# EAGLE design testbed (EAGLE 5.09)
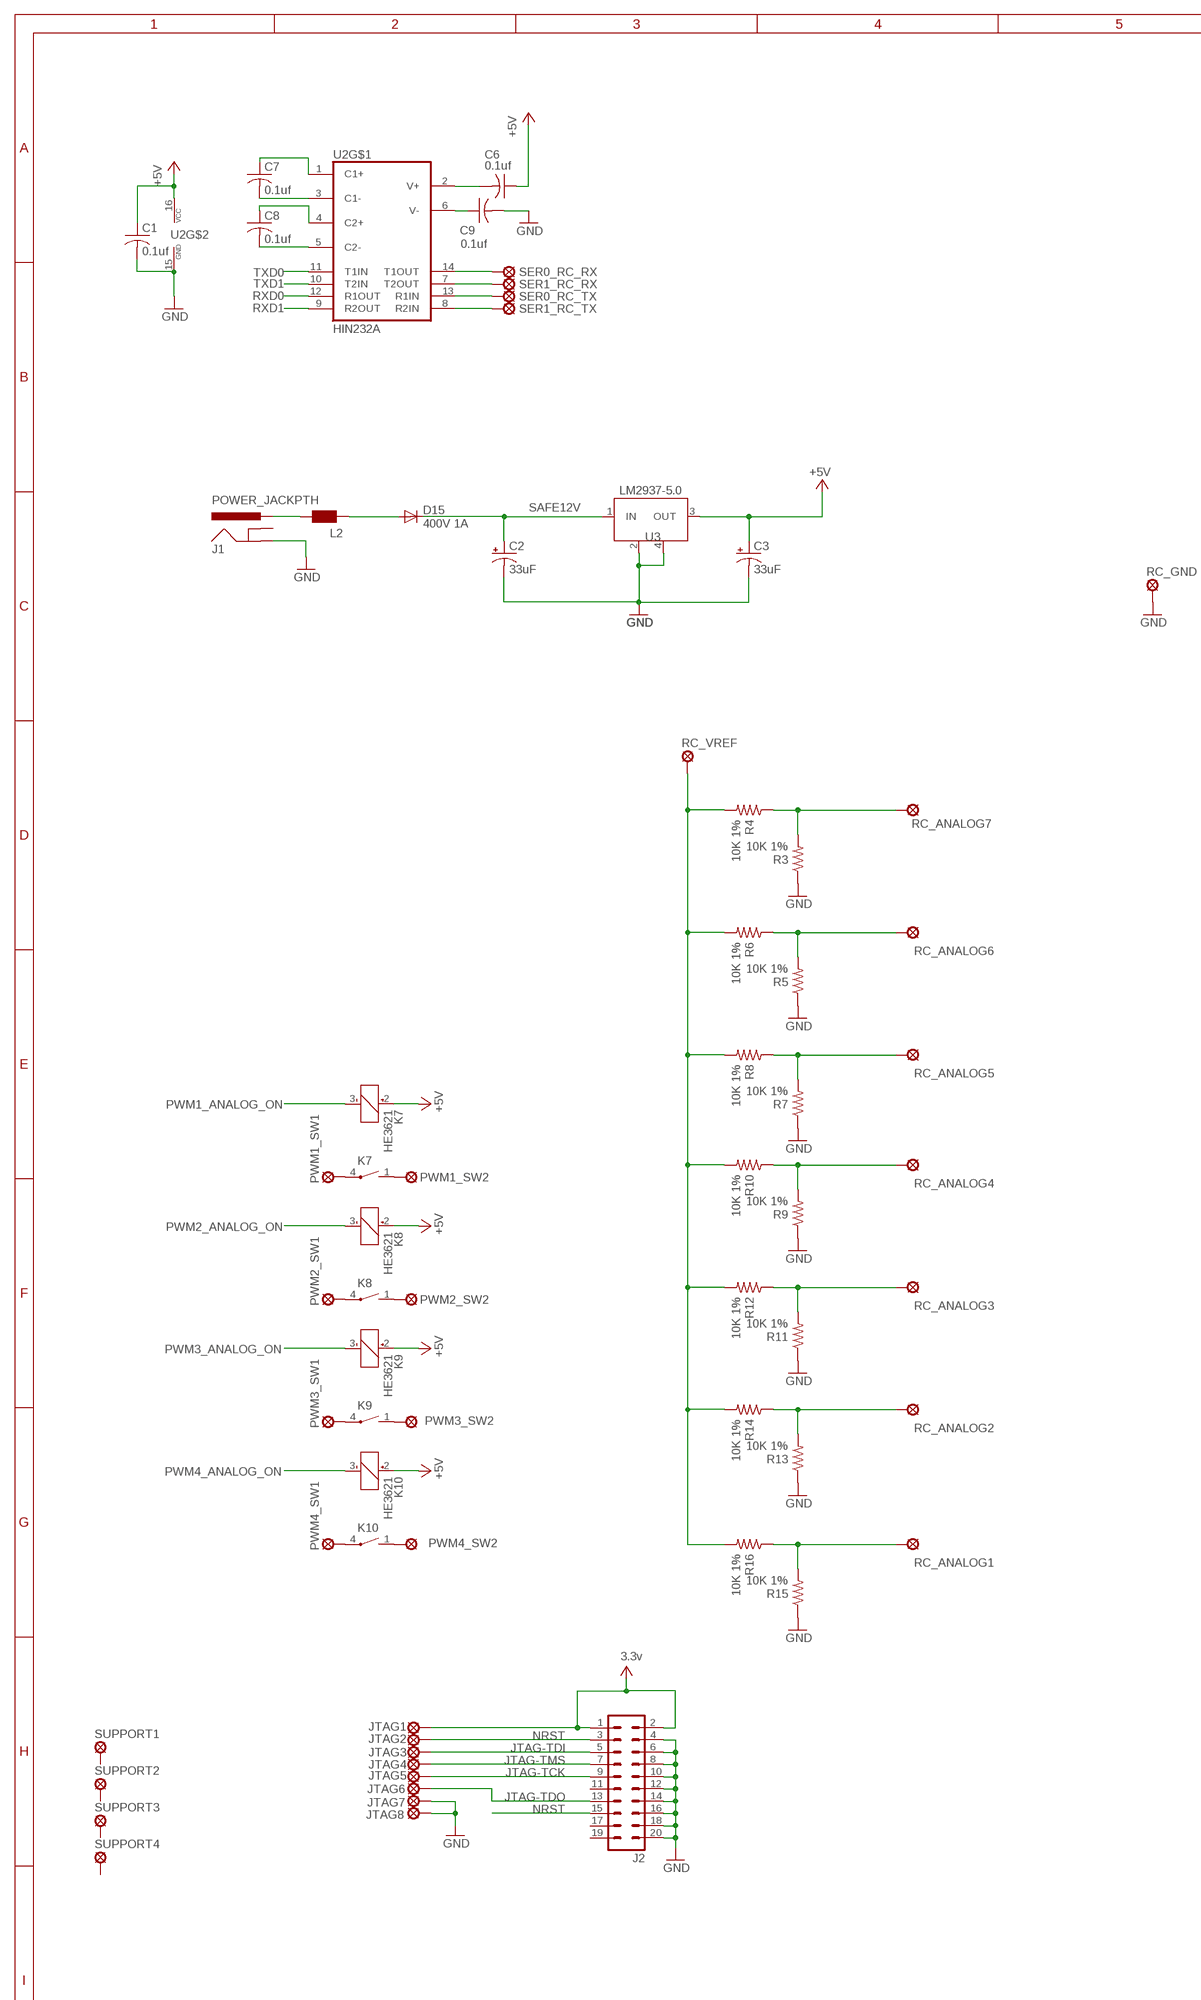
[diagram p0: schematic, sheet 1, part 1 of 2]
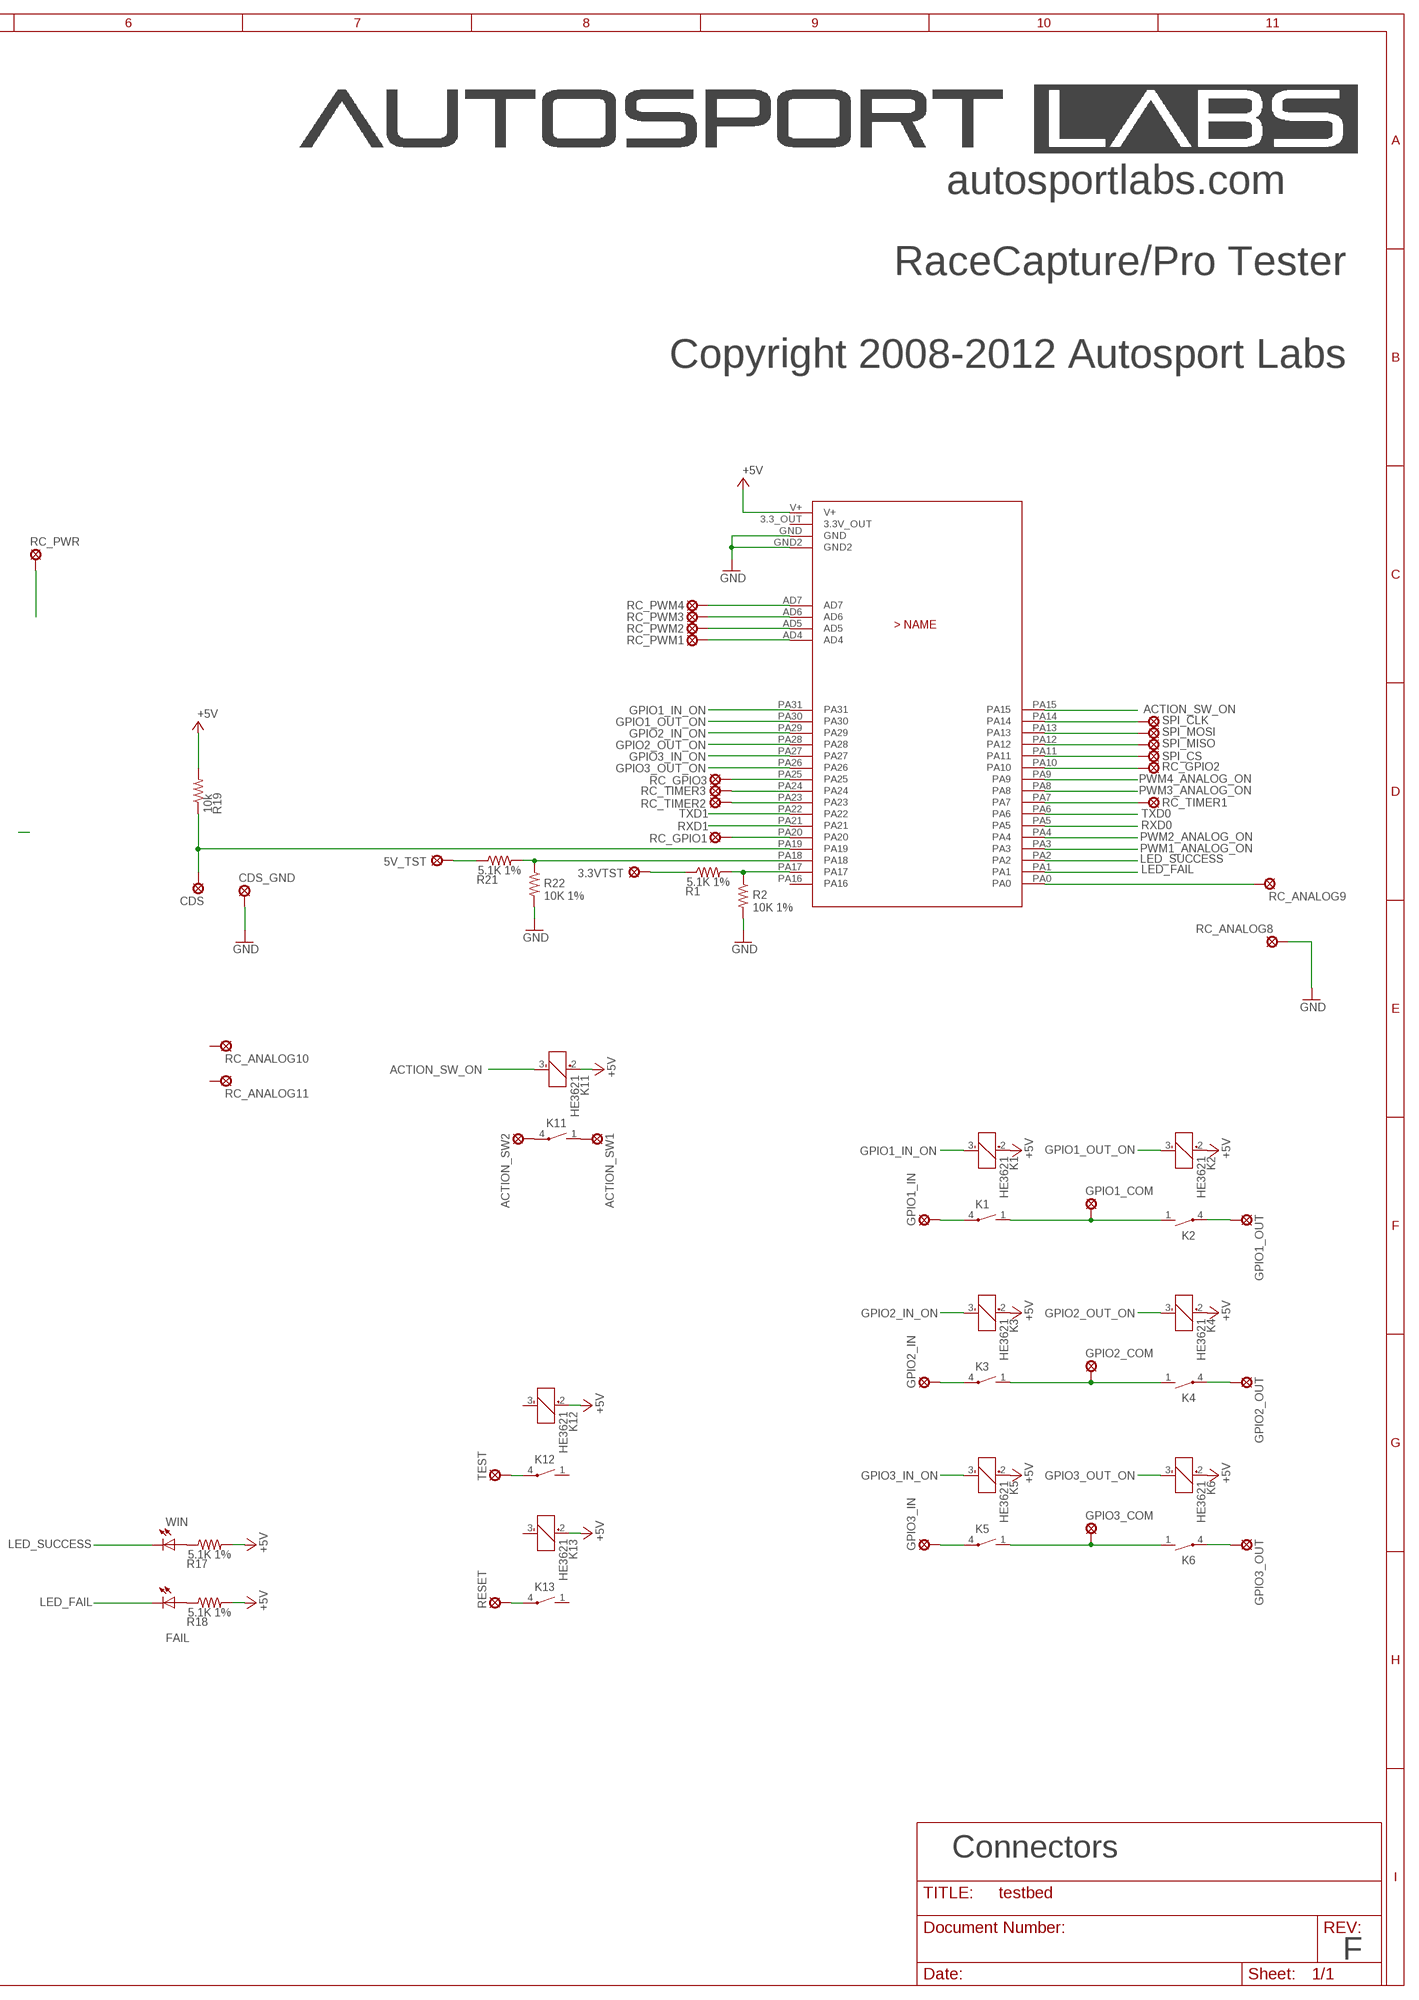
[diagram p1: schematic, sheet 1, part 2 of 2]

## Parts
3.3VTST  SE14  [SE14]
5V_TST  SE14  [SE14]
ACTION_SW1  SE14  [SE14]
ACTION_SW2  SE14  [SE14]
C1  0.1uf  C-USC0603  [C0603]
C2  33uF  CPOL-US153CLV-0605  [153CLV-0605]
C3  33uF  CPOL-USSMCD  [SMC_D]
C6  0.1uf  C-USC0603  [C0603]
C7  0.1uf  C-USC0603  [C0603]
C8  0.1uf  C-USC0603  [C0603]
C9  0.1uf  C-USC0603  [C0603]
CDS  SE14  [SE14]
CDS_GND  SE14  [SE14]
CPU1  CPU_MODULE  [CPU_MODULE]
D15  400V 1A  DIODE1  [SMA]
FAIL  LED5MM  [LED5MM]
GPIO1_COM  SE14  [SE14]
GPIO1_IN  SE14  [SE14]
GPIO1_OUT  SE14  [SE14]
GPIO2_COM  SE14  [SE14]
GPIO2_IN  SE14  [SE14]
GPIO2_OUT  SE14  [SE14]
GPIO3_COM  SE14  [SE14]
GPIO3_IN  SE14  [SE14]
GPIO3_OUT  SE14  [SE14]
J1  POWER_JACKPTH  [POWER_JACK_PTH]
J2  MA10-2  [MA10-2]
JTAG1  SE14  [SE14]
JTAG2  SE14  [SE14]
JTAG3  SE14  [SE14]
JTAG4  SE14  [SE14]
JTAG5  SE14  [SE14]
JTAG6  SE14  [SE14]
JTAG7  SE14  [SE14]
JTAG8  SE14  [SE14]
K1  HE3621  [HE3621]
K2  HE3621  [HE3621]
K3  HE3621  [HE3621]
K4  HE3621  [HE3621]
K5  HE3621  [HE3621]
K6  HE3621  [HE3621]
K7  HE3621  [HE3621]
K8  HE3621  [HE3621]
K9  HE3621  [HE3621]
K10  HE3621  [HE3621]
K11  HE3621  [HE3621]
K12  HE3621  [HE3621]
K13  HE3621  [HE3621]
L2  WE-CBF_1812  [1812]
PWM1_SW1  SE14  [SE14]
PWM1_SW2  SE14  [SE14]
PWM2_SW1  SE14  [SE14]
PWM2_SW2  SE14  [SE14]
PWM3_SW1  SE14  [SE14]
PWM3_SW2  SE14  [SE14]
PWM4_SW1  SE14  [SE14]
PWM4_SW2  SE14  [SE14]
R1  5.1K 1%  R-US_R0603  [R0603]
R2  10K 1%  R-US_R0603  [R0603]
R3  10K 1%  R-US_R0603  [R0603]
R4  10K 1%  R-US_R0603  [R0603]
R5  10K 1%  R-US_R0603  [R0603]
R6  10K 1%  R-US_R0603  [R0603]
R7  10K 1%  R-US_R0603  [R0603]
R8  10K 1%  R-US_R0603  [R0603]
R9  10K 1%  R-US_R0603  [R0603]
R10  10K 1%  R-US_R0603  [R0603]
R11  10K 1%  R-US_R0603  [R0603]
R12  10K 1%  R-US_R0603  [R0603]
R13  10K 1%  R-US_R0603  [R0603]
R14  10K 1%  R-US_R0603  [R0603]
R15  10K 1%  R-US_R0603  [R0603]
R16  10K 1%  R-US_R0603  [R0603]
R17  5.1K 1%  R-US_R0603  [R0603]
R18  5.1K 1%  R-US_R0603  [R0603]
R19  10k  R-US_R0603  [R0603]
R21  5.1K 1%  R-US_R0603  [R0603]
R22  10K 1%  R-US_R0603  [R0603]
RC_ANALOG1  SE14  [SE14]
RC_ANALOG2  SE14  [SE14]
RC_ANALOG3  SE14  [SE14]
RC_ANALOG4  SE14  [SE14]
RC_ANALOG5  SE14  [SE14]
RC_ANALOG6  SE14  [SE14]
RC_ANALOG7  SE14  [SE14]
RC_ANALOG8  SE14  [SE14]
RC_ANALOG9  SE14  [SE14]
RC_ANALOG10  SE14  [SE14]
RC_ANALOG11  SE14  [SE14]
RC_GND  SE14  [SE14]
RC_GPIO1  SE14  [SE14]
RC_GPIO2  SE14  [SE14]
RC_GPIO3  SE14  [SE14]
RC_PWM1  SE14  [SE14]
RC_PWM2  SE14  [SE14]
RC_PWM3  SE14  [SE14]
RC_PWM4  SE14  [SE14]
RC_PWR  SE14  [SE14]
RC_TIMER1  SE14  [SE14]
RC_TIMER2  SE14  [SE14]
RC_TIMER3  SE14  [SE14]
RC_VREF  SE14  [SE14]
RESET  SE14  [SE14]
SER0_RC_RX  SE14  [SE14]
SER0_RC_TX  SE14  [SE14]
SER1_RC_RX  SE14  [SE14]
SER1_RC_TX  SE14  [SE14]
SPI_CLK  SE14  [SE14]
SPI_CS  SE14  [SE14]
SPI_MISO  SE14  [SE14]
SPI_MOSI  SE14  [SE14]
SUPPORT1  SE14  [SE14]
SUPPORT2  SE14  [SE14]
SUPPORT3  SE14  [SE14]
SUPPORT4  SE14  [SE14]
TEST  SE14  [SE14]
U2  HIN232A  [SOIC-16]
U3  LM2937-5.0  LM2937  [SOT223]
WIN  LED5MM  [LED5MM]

## Nets
+5V: C1.1 C3.+ C6.1 CPU1.V+ K1.2(1:+) K2.2(1:+) K3.2(1:+) K4.2(1:+) K5.2(1:+) K6.2(1:+) K7.2(1:+) K8.2(1:+) K9.2(1:+) K10.2(1:+) K11.2(1:+) K12.2(1:+) K13.2(1:+) R17.2 R18.2 R19.2 U2.16(VCC) U3.3(OUT)
+12V: J1.PWR L2.2 RC_PWR.MP
ACTION_SW_ON: CPU1.PA15 K11.3(1:-)
ANALOG_4_ADC: CPU1.PA18 R21.2 R22.1
ANALOG_4_ADC1: CPU1.PA17 R1.2 R2.1
ANALOG_4_IN: 5V_TST.MP R21.1
GND: C1.2 C2.- C3.- C9.2 CDS_GND.MP CPU1.GND CPU1.GND2 J1.GND J2.4 J2.6 J2.8 J2.10 J2.12 J2.14 J2.16 J2.18 J2.20 JTAG7.MP JTAG8.MP R2.2 R3.1 R5.1 R7.1 R9.1 R11.1 R13.1 R15.1 R22.2 RC_ANALOG8.MP RC_GND.MP U2.15(GND) U3.2(GND) U3.4(GND_TAB)
GPIO1_IN_ON: CPU1.PA31 K1.3(1:-)
GPIO1_OUT_ON: CPU1.PA30 K2.3(1:-)
GPIO2_IN_ON: CPU1.PA29 K3.3(1:-)
GPIO2_OUT_ON: CPU1.PA28 K4.3(1:-)
GPIO3_IN_ON: CPU1.PA27 K5.3(1:-)
GPIO3_OUT_ON: CPU1.PA26 K6.3(1:-)
JTAG-TCK: J2.9 JTAG5.MP
JTAG-TDI: J2.5 JTAG3.MP
JTAG-TDO: J2.13 JTAG6.MP
JTAG-TMS: J2.7 JTAG4.MP
LED_FAIL: CPU1.PA1 FAIL.K(C)
LED_SUCCESS: CPU1.PA2 WIN.K(C)
N$2: GPIO1_IN.MP K1.4(2:P)
N$3: GPIO1_OUT.MP K2.4(2:P)
N$4: GPIO2_IN.MP K3.4(2:P)
N$5: GPIO2_OUT.MP K4.4(2:P)
N$6: GPIO3_IN.MP K5.4(2:P)
N$8: GPIO3_OUT.MP K6.4(2:P)
N$9: R3.2 R4.1 RC_ANALOG7.MP
N$10: CPU1.PA23 RC_TIMER2.MP
N$11: CPU1.PA24 RC_TIMER3.MP
N$12: GPIO1_COM.MP K1.1(2:S) K2.1(2:S)
N$13: GPIO2_COM.MP K3.1(2:S) K4.1(2:S)
N$14: CPU1.PA20 RC_GPIO1.MP
N$16: 3.3VTST.MP R1.1
N$17: K7.4(2:P) PWM1_SW1.MP
N$18: CPU1.AD7 RC_PWM4.MP
N$19: CPU1.AD6 RC_PWM3.MP
N$20: CPU1.AD5 RC_PWM2.MP
N$21: CPU1.AD4 RC_PWM1.MP
N$22: R5.2 R6.1 RC_ANALOG6.MP
N$23: CPU1.PA14 SPI_CLK.MP
N$24: CPU1.PA13 SPI_MOSI.MP
N$25: CPU1.PA12 SPI_MISO.MP
N$26: CPU1.PA11 SPI_CS.MP
N$27: CPU1.PA10 RC_GPIO2.MP
N$28: R7.2 R8.1 RC_ANALOG5.MP
N$29: R9.2 R10.1 RC_ANALOG4.MP
N$30: R11.2 R12.1 RC_ANALOG3.MP
N$31: GPIO3_COM.MP K5.1(2:S) K6.1(2:S)
N$32: ACTION_SW1.MP K11.1(2:S)
N$33: R13.2 R14.1 RC_ANALOG2.MP
N$34: R15.2 R16.1 RC_ANALOG1.MP
N$35: CPU1.PA0 RC_ANALOG9.MP
N$36: D15.A L2.1
N$37: CDS.MP CPU1.PA19 R19.1
N$38: C7.1 U2.1(C1+)
N$39: C7.2 U2.3(C1-)
N$40: C8.1 U2.4(C2+)
N$41: C8.2 U2.5(C2-)
N$42: C6.2 U2.2(V+)
N$43: C9.1 U2.6(V-)
N$44: SER0_RC_TX.MP U2.13(R1IN)
N$45: SER0_RC_RX.MP U2.14(T1OUT)
N$46: SER1_RC_TX.MP U2.8(R2IN)
N$47: SER1_RC_RX.MP U2.7(T2OUT)
N$48: ACTION_SW2.MP K11.4(2:P)
N$49: K12.4(2:P) TEST.MP
N$50: K13.4(2:P) RESET.MP
N$51: R17.1 WIN.A
N$52: K7.1(2:S) PWM1_SW2.MP
N$53: K8.4(2:P) PWM2_SW1.MP
N$54: K8.1(2:S) PWM2_SW2.MP
N$55: K9.4(2:P) PWM3_SW1.MP
N$56: K9.1(2:S) PWM3_SW2.MP
N$57: K10.4(2:P) PWM4_SW1.MP
N$58: K10.1(2:S) PWM4_SW2.MP
N$59: R4.2 R6.2 R8.2 R10.2 R12.2 R14.2 R16.2 RC_VREF.MP
N$60: CPU1.PA25 RC_GPIO3.MP
N$61: FAIL.A R18.1
NRST: J2.3 J2.15 JTAG2.MP
PWM1_ANALOG_ON: CPU1.PA3 K7.3(1:-)
PWM2_ANALOG_ON: CPU1.PA4 K8.3(1:-)
PWM3_ANALOG_ON: CPU1.PA8 K9.3(1:-)
PWM4_ANALOG_ON: CPU1.PA9 K10.3(1:-)
RXD0: CPU1.PA5 U2.12(R1OUT)
RXD1: CPU1.PA21 U2.9(R2OUT)
SAFE12V: C2.+ D15.C U3.1(IN)
TIMER0_STIM: CPU1.PA7 RC_TIMER1.MP
TXD0: CPU1.PA6 U2.11(T1IN)
TXD1: CPU1.PA22 U2.10(T2IN)
V+: J2.1 J2.2 JTAG1.MP ; supply symbol labelled 3.3v
Unconnected: CPU1.3.3_OUT(3.3V_OUT) CPU1.PA16 J1.GNDBREAK J2.11 J2.17 J2.19 K12.1(2:S) K12.3(1:-) K13.1(2:S) K13.3(1:-) RC_ANALOG10.MP RC_ANALOG11.MP SUPPORT1.MP SUPPORT2.MP SUPPORT3.MP SUPPORT4.MP

## Notes on the sheet
- autosportlabs.com
- RaceCapture/Pro Tester
- Copyright 2008-2012 Autosport Labs
- Connectors
- F

## Library data of the parts
3.3VTST 5V_TST ACTION_SW1 ACTION_SW2 CDS CDS_GND GPIO1_COM GPIO1_IN GPIO1_OUT GPIO2_COM GPIO2_IN GPIO2_OUT GPIO3_COM GPIO3_IN GPIO3_OUT JTAG1-JTAG8 PWM1_SW1 PWM1_SW2 PWM2_SW1 PWM2_SW2 PWM3_SW1 PWM3_SW2 PWM4_SW1 PWM4_SW2 RC_ANALOG1-RC_ANALOG11 RC_GND RC_GPIO1-RC_GPIO3 RC_PWM1-RC_PWM4 RC_PWR RC_TIMER1-RC_TIMER3 RC_VREF RESET SER0_RC_RX SER0_RC_TX SER1_RC_RX SER1_RC_TX SPI_CLK SPI_CS SPI_MISO SPI_MOSI SUPPORT1-SUPPORT4 TEST = solpad:SE14: SOLDER PAD E1553, drill 1,4mm, distributor Buerklin, 07F820
C1 C6-C9 = rcl:C-US: CAPACITOR, American symbol
C2 C3 = rcl:CPOL-US: POLARIZED CAPACITOR, American symbol
CPU1 = cpu_module:CPU_MODULE
D15 = smt_diodes:DIODE
FAIL WIN = led:LED: LED OSRAM: - CHIPLED LG R971, LG N971, LY N971, LG Q971, LY Q971, LO R971, LY R971 LH N974, LH R974 LS Q976, LO Q976, LY Q976 LO Q996 - Hyper CHIPLED LW Q18S LB Q993, LB Q99A, LB R99A - SideLED LS A670, LO A670, LY A670, LG A670, LP A670 LB A673, LV A673, LT A673, LW A673 LH A674 LY A675 LS A676, LA A676, LO A676, LY A676, LW A676 LS A679, LY A679, LG A679 - Hyper Micro SIDELED® LS Y876, LA Y876, LO Y876, LY Y876 LT Y87S - SmartLED LW L88C, LW L88S LB L89C, LB L89S, LG L890 LS L89K, LO L89K, LY L89K LS L896, LA L896, LO L896, LY L896 - TOPLED LS T670, LO T670, LY T670, LG T670, LP T670 LSG T670, LSP T670, LSY T670, LOP T670, LYG T670 LG T671, LOG T671, LSG T671 LB T673, LV T673, LT T673, LW T673 LH T674 LS T676, LA T676, LO T676, LY T676, LB T676, LH T676, LSB T676, LW T676 LB T67C, LV T67C, LT T67C, LS T67K, LO T67K, LY T67K, LW E67C LS E67B, LA E67B, LO E67B, LY E67B, LB E67C, LV E67C, LT E67C LW T67C LS T679, LY T679, LG T679 LS T770, LO T770, LY T770, LG T770, LP T770 LB T773, LV T773, LT T773, LW T773 LH T774 LS E675, LA E675, LY E675, LS T675 LS T776, LA T776, LO T776, LY T776, LB T776 LHGB T686 LT T68C, LB T68C - Hyper Mini TOPLED® LB M676 - Mini TOPLED Santana® LG M470 LS M47K, LO M47K, LY M47K Source: http://www.osram.convergy.de - LUMILED® LXK2-PW12-R00, LXK2-PW12-S00, LXK2-PW14-U00, LXK2-PW14-V00 LXK2-PM12-R00, LXK2-PM12-S00, LXK2-PM14-U00 LXK2-PE12-Q00, LXK2-PE12-R00, LXK2-PE12-S00, LXK2-PE14-T00, LXK2-PE14-U00 LXK2-PB12-K00, LXK2-PB12-L00, LXK2-PB12-M00, LXK2-PB14-N00, LXK2-PB14-P00, LXK2-PB14-Q00 LXK2-PR12-L00, LXK2-PR12-M00, LXK2-PR14-Q00, LXK2-PR14-R00 LXK2-PD12-Q00, LXK2-PD12-R00, LXK2-PD12-S00 LXK2-PH12-R00, LXK2-PH12-S00 LXK2-PL12-P00, LXK2-PL12-Q00, LXK2-PL12-R00 Source: www.luxeon.com
J1 = SparkFun:POWER_JACK: Power Jack This is the standard 5.5mm barrel jack for power. The PTH is the most common, proven, reliable, footprint. All others are experimental. The Slot footprint only works if the mill layer is transmitted to the PCB fab house so be warned. Spark Fun Electronics SKU : PRT-00119. Mating wall wart : TOL-00298 (and others)
J2 = con-lstb:MA10-2: PIN HEADER
K1-K13 = relay:HE3621: RELAY reed, 1 x norm. open, grid 5.08 mm, Hamlin
L2 = wuerth-elektronik:WE-CBF: SMD EMI Suppression Ferrite Beads - excellent anti-EMI properties - low DCR - impedances till 3000 ohms - rated current up to 6 A
R1-R19 R21 R22 = rcl:R-US_: RESISTOR, American symbol
U2 = max232:HIN232A
U3 = voltage_regulators:LM2937

## Board
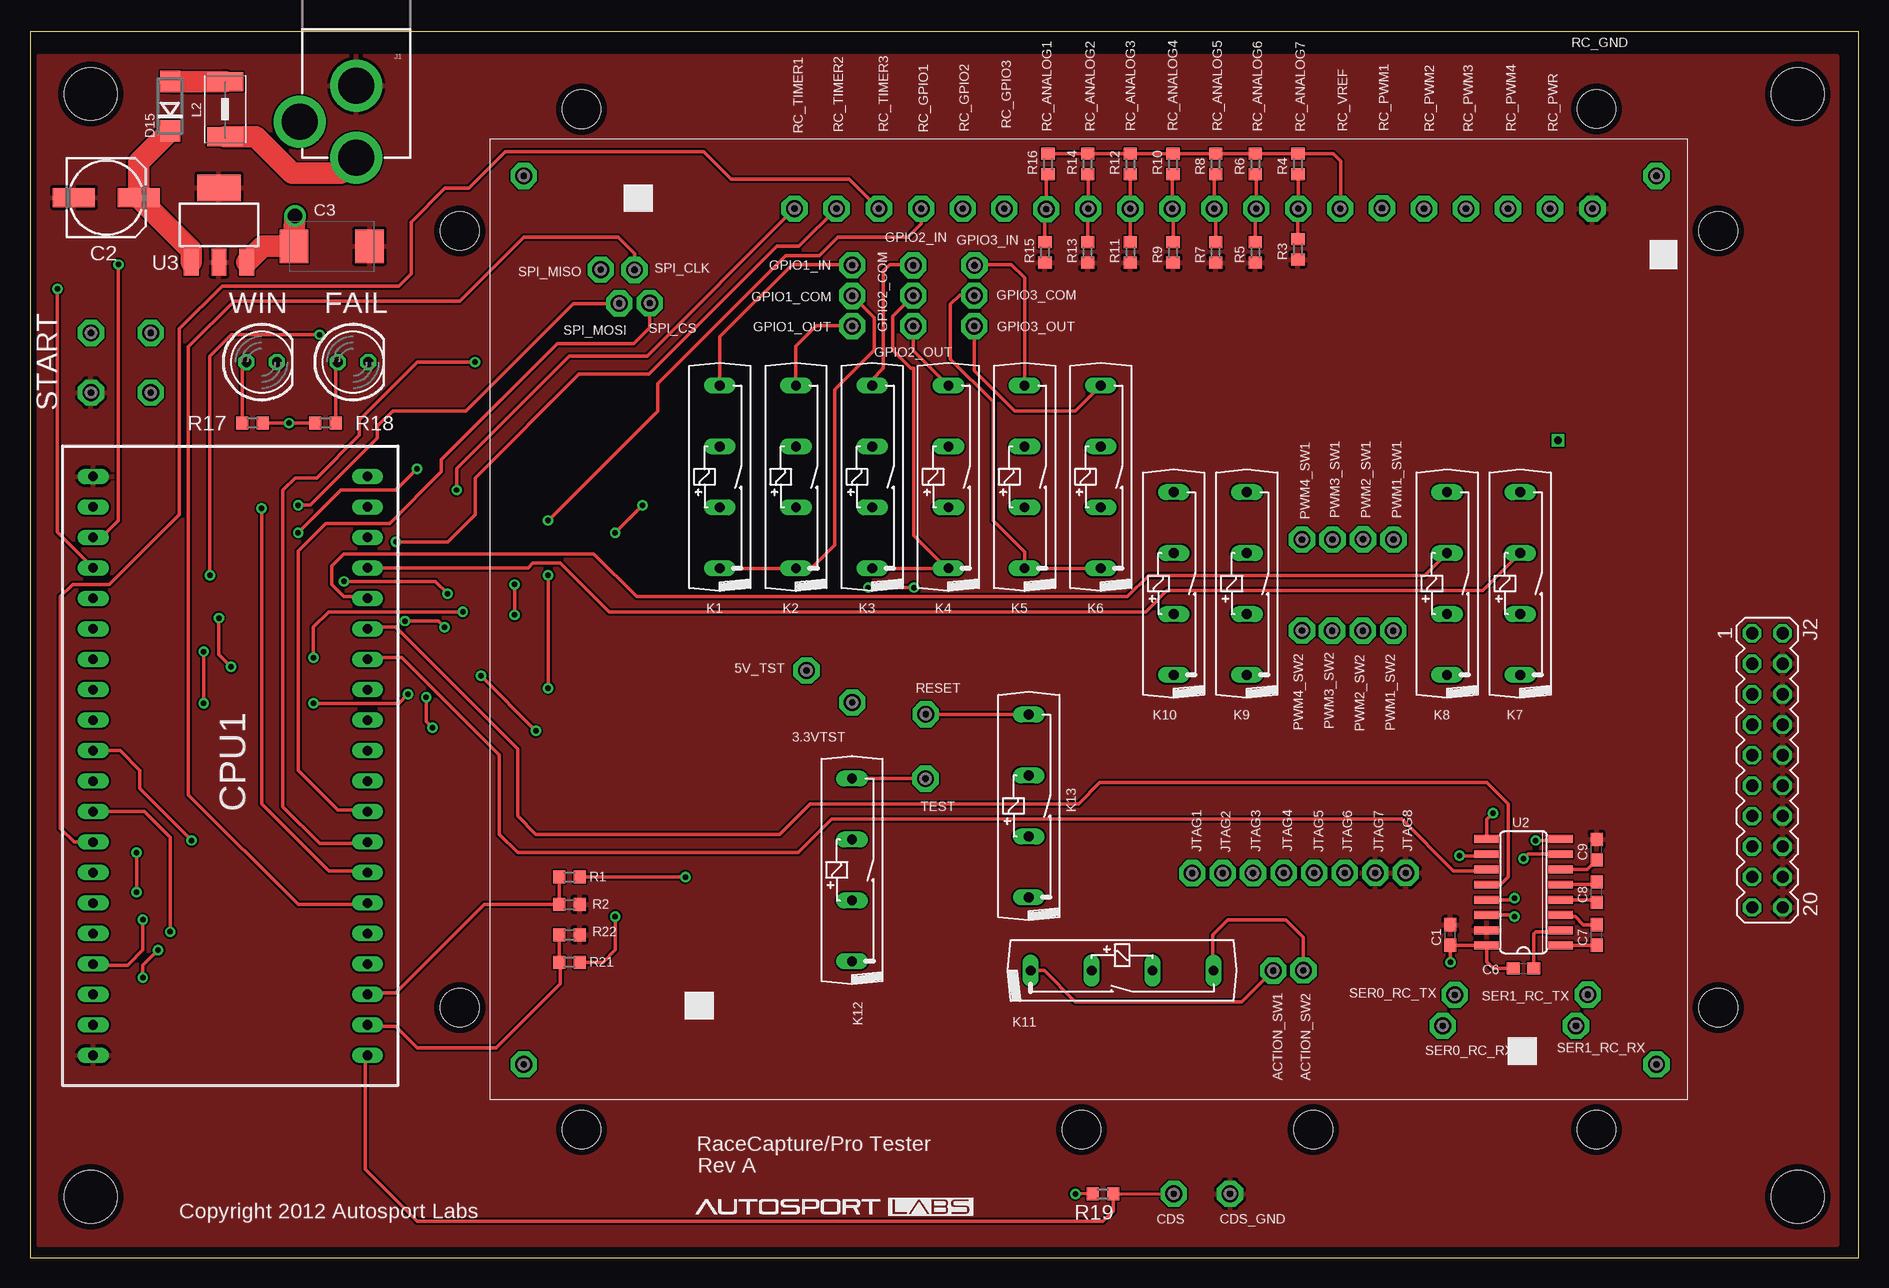
[diagram p2: board, top side]
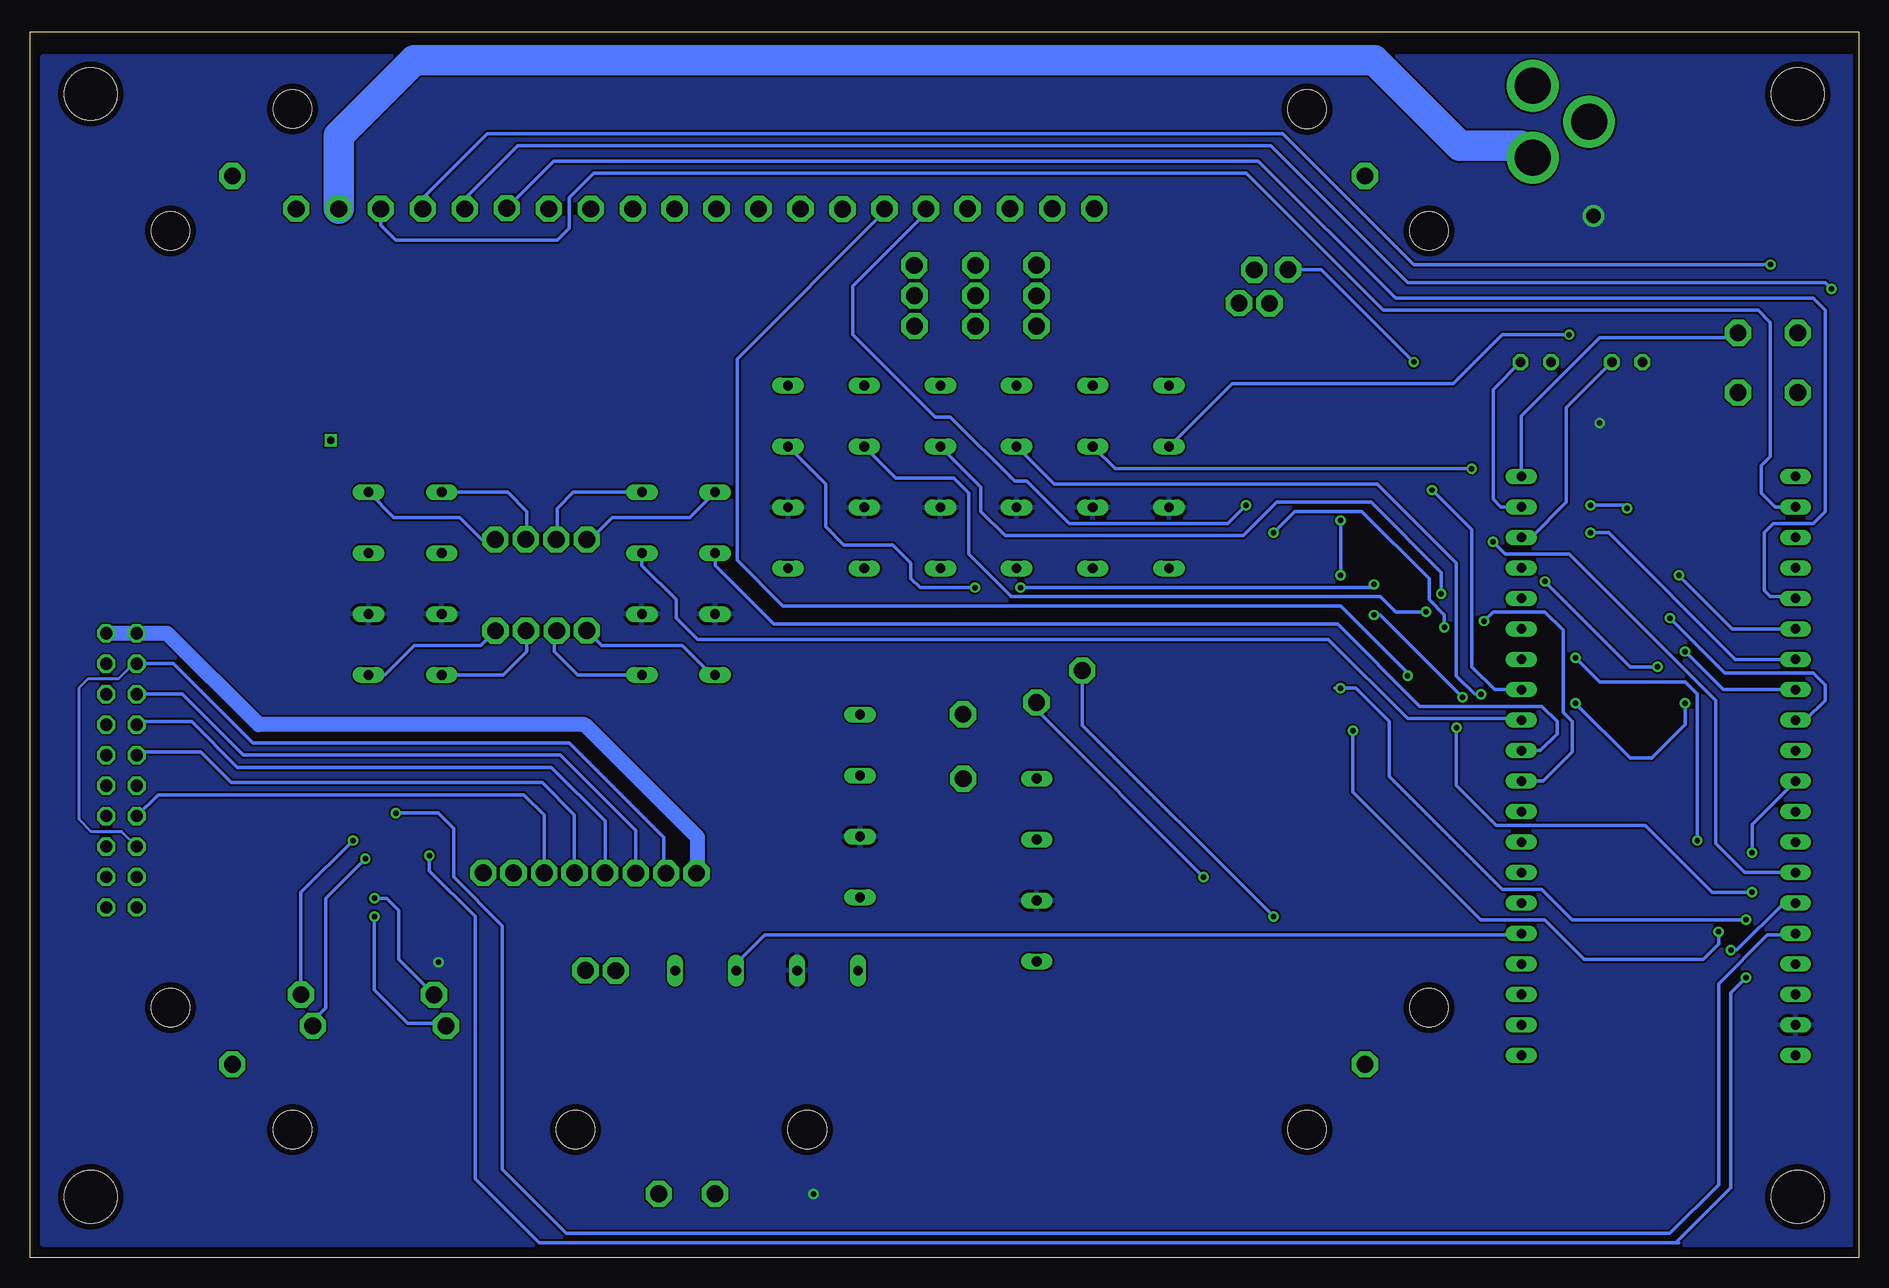
[diagram p3: board, bottom side, seen from below]

Size 152.4 x 102.2 mm. Coordinates in mm from the lower left corner, seen from the top.
Outline: 0,0 152.4,0 152.4,102.2 0,102.2 0,0
Copper layers (1+2*15+16): Top 0.035mm / dielectric 1.5mm / Route2 0.035mm / dielectric 0.15mm / Route15 0.035mm / dielectric 0.2mm / Bottom 0.035mm
Design rules "default *": minimum track width 8mil, minimum drill 14mil, track to track 6mil, track to pad 6mil, pad to pad 8mil, via to via 6mil, smd to smd 6mil, copper to edge 20mil, drill to drill 8mil, minimum pad ring 10mil, minimum via ring 8mil, stop-mask expansion 4mil, vias tented up to drill 24mil, thermal gap 10mil
Holes 4.39 mm at 5.08,97.03 5.08,5.08 147.32,97.03 147.32,5.08
Holes 3.2 mm at 35.81,85.6 45.97,95.76 35.81,20.85 45.97,10.69 130.53,10.69 140.69,20.85 140.69,85.62 130.53,95.78 87.63,10.69 106.93,10.69

### Footprints (pad centres in the part's own frame; a part is rotated, then mirrored left to right if it is on the bottom)
SE14 = drill 1.397 pad 2.184 octagon: MP 0,0
C0603 = smd 1.1 x 1: 1 -0.85,0; 2 0.85,0
153CLV-0605 = smd 3.5 x 1.6: + 2.7,0; - -2.7,0
SMC_D = smd 2.4 x 2.8: + -3.15,0; - 3.15,0
CPU_MODULE = drill 0.8 long: 3.3_OUT -19.05,11.43; AD4 13.97,11.43; AD5 16.51,11.43; AD6 19.05,11.43; AD7 21.59,11.43; GND -24.13,11.43; GND2 24.13,11.43; PA0 24.13,-11.43; PA1 21.59,-11.43; PA2 19.05,-11.43; PA3 16.51,-11.43; PA4 13.97,-11.43; PA5 11.43,-11.43; PA6 8.89,-11.43; PA7 6.35,-11.43; PA8 3.81,-11.43; PA9 1.27,-11.43; PA10 -1.27,-11.43; PA11 -3.81,-11.43; PA12 -6.35,-11.43; PA13 -8.89,-11.43; PA14 -11.43,-11.43; PA15 -13.97,-11.43; PA16 -16.51,-11.43; PA17 -19.05,-11.43; PA18 -21.59,-11.43; PA19 -24.13,-11.43; PA20 -16.51,11.43; PA21 -13.97,11.43; PA22 -11.43,11.43; PA23 -8.89,11.43; PA24 -6.35,11.43; PA25 -3.81,11.43; PA26 -1.27,11.43; PA27 1.27,11.43; PA28 3.81,11.43; PA29 6.35,11.43; PA30 8.89,11.43; PA31 11.43,11.43; V+ -21.59,11.43
SMA = smd 1.8 x 1.7: A 2.05,0; C -2.05,0
LED5MM = drill 0.813 octagon: A -1.27,0; K 1.27,0
POWER_JACK_PTH = drill 2.997 pad 4.318 round: GND 0,7.7; GNDBREAK 4.7,10.7; PWR 0,13.7
MA10-2 = drill 1.016 octagon: 1 -11.43,-1.27; 2 -11.43,1.27; 3 -8.89,-1.27; 4 -8.89,1.27; 5 -6.35,-1.27; 6 -6.35,1.27; 7 -3.81,-1.27; 8 -3.81,1.27; 9 -1.27,-1.27; 10 -1.27,1.27; 11 1.27,-1.27; 12 1.27,1.27; 13 3.81,-1.27; 14 3.81,1.27; 15 6.35,-1.27; 16 6.35,1.27; 17 8.89,-1.27; 18 8.89,1.27; 19 11.43,-1.27; 20 11.43,1.27
HE3621 = drill 0.813 long: 1 -7.62,0; 2 -2.54,0; 3 2.54,0; 4 7.62,0
1812 = smd 1.6 x 3: 1 -2.3,0; 2 2.3,0
R0603 = smd 1 x 1.1: 1 -0.85,0; 2 0.85,0
SOIC-16 = smd 0.66 x 2.032: 1 -4.445,-3.073; 2 -3.175,-3.073; 3 -1.905,-3.073; 4 -0.635,-3.073; 5 0.635,-3.073; 6 1.905,-3.073; 7 3.175,-3.073; 8 4.445,-3.073; 9 4.445,3.073; 10 3.175,3.073; 11 1.905,3.073; 12 0.635,3.073; 13 -0.635,3.073; 14 -1.905,3.073; 15 -3.175,3.073; 16 -4.445,3.073
SOT223 = smd 1.219 x 2.235: 1 -2.311,-3.099; 2 0,-3.099; 3 2.311,-3.099 | smd 3.6 x 2.2: 4 0,3.099

### Placement (x,y rotation side)
3.3VTST  68.52,46.29 0 top
5V_TST  64.71,48.97 0 top
ACTION_SW1  103.59,23.95 0 top
ACTION_SW2  106.12,23.96 0 top
C1  118.36,26.92 90 top
C2  6.35,88.39 0 top
C3  25.15,84.33 0 top
C6  124.46,24.13 0 top
C7  130.56,26.92 90 top
C8  130.56,30.48 90 top
C9  130.56,34.04 90 top
CDS  95.32,5.33 0 top
CDS_GND  100,5.33 180 top
CPU1  16.69,41.01 90 top
D15  11.68,96.01 90 top
FAIL  26.92,74.68 0 top
GPIO1_COM  68.52,80.2 0 top
GPIO1_IN  68.52,82.75 0 top
GPIO1_OUT  68.52,77.68 0 top
GPIO2_COM  73.6,80.22 0 top
GPIO2_IN  73.6,82.74 0 top
GPIO2_OUT  73.6,77.67 0 top
GPIO3_COM  78.68,80.21 0 top
GPIO3_IN  78.71,82.74 0 top
GPIO3_OUT  78.68,77.68 0 top
J1  27.18,105.41 180 top
J2  144.78,40.64 270 top
JTAG1  96.86,32.06 90 top
JTAG2  99.39,32.07 90 top
JTAG3  101.92,32.07 90 top
JTAG4  104.48,32.08 90 top
JTAG5  107.03,32.08 90 top
JTAG6  109.56,32.08 90 top
JTAG7  112.11,32.08 90 top
JTAG8  114.64,32.08 90 top
K1  57.48,65.1 90 top
K2  63.83,65.1 90 top
K3  70.18,65.1 90 top
K4  76.53,65.1 90 top
K5  82.88,65.1 90 top
K6  89.23,65.1 90 top
K7  124.19,56.21 90 top
K8  118.09,56.21 90 top
K9  101.4,56.21 90 top
K10  95.31,56.21 90 top
K11  91.01,23.95 0 top
K12  68.5,32.34 90 top
K13  83.23,37.67 90 top
L2  16.26,95.76 270 top
PWM1_SW1  113.63,59.89 90 top
PWM1_SW2  113.61,52.28 180 top
PWM2_SW1  111.08,59.9 90 top
PWM2_SW2  111.07,52.28 90 top
PWM3_SW1  108.54,59.89 270 top
PWM3_SW2  108.51,52.27 270 top
PWM4_SW1  106,59.89 270 top
PWM4_SW2  105.99,52.29 90 top
R1  44.96,31.75 180 top
R2  44.96,29.46 0 top
R3  105.66,84.07 90 top
R4  105.66,91.19 90 top
R5  102.11,83.82 90 top
R6  102.11,91.19 90 top
R7  98.81,83.82 90 top
R8  98.81,91.19 90 top
R9  95.25,83.82 90 top
R10  95.25,91.19 90 top
R11  91.69,83.82 90 top
R12  91.69,91.19 90 top
R13  88.14,83.82 90 top
R14  88.14,91.19 90 top
R15  84.58,83.82 90 top
R16  84.84,91.19 90 top
R17  18.54,69.6 0 top
R18  24.64,69.6 180 top
R19  89.41,5.33 180 top
R21  44.96,24.64 180 top
R22  44.96,26.92 0 top
RC_ANALOG1  84.69,87.42 0 top
RC_ANALOG2  88.19,87.45 0 top
RC_ANALOG3  91.69,87.45 0 top
RC_ANALOG4  95.19,87.45 0 top
RC_ANALOG5  98.68,87.45 0 top
RC_ANALOG6  102.18,87.45 0 top
RC_ANALOG7  105.68,87.45 0 top
RC_ANALOG8  5.08,72.14 90 top
RC_ANALOG9  10.06,77.11 90 top
RC_ANALOG10  10.06,72.14 90 top
RC_ANALOG11  5.08,77.11 90 top
RC_GND  130.21,87.45 0 top
RC_GPIO1  74.27,87.46 90 top
RC_GPIO2  77.73,87.45 90 top
RC_GPIO3  81.19,87.45 0 top
RC_PWM1  112.67,87.5 0 top
RC_PWM2  116.17,87.45 0 top
RC_PWM3  119.67,87.45 0 top
RC_PWM4  123.17,87.45 0 top
RC_PWR  126.66,87.45 0 top
RC_TIMER1  63.71,87.46 90 top
RC_TIMER2  67.21,87.46 90 top
RC_TIMER3  70.74,87.46 90 top
RC_VREF  109.18,87.45 0 top
RESET  74.65,45.32 0 top
SER0_RC_RX  117.73,19.34 0 top
SER0_RC_TX  118.73,21.94 0 top
SER1_RC_RX  128.83,19.35 0 top
SER1_RC_TX  129.82,21.95 0 top
SPI_CLK  50.38,82.36 0 top
SPI_CS  51.65,79.58 0 top
SPI_MISO  47.56,82.38 0 top
SPI_MOSI  49.11,79.57 0 top
SUPPORT1  41.15,16.13 0 top
SUPPORT2  41.15,90.2 0 top
SUPPORT3  135.53,16.13 0 top
SUPPORT4  135.53,90.2 0 top
TEST  74.62,39.95 0 top
U2  124.46,30.48 90 top
U3  15.75,86.11 0 top
WIN  19.3,74.68 0 top

### Tracks (layer width: path | path; a pad name or v marks a point on that pad's centre or on a via)
+5V  (via drill 0.46, 1.2)
  Top 0.254: R19.2 v87.12,5.33
  Top 0.305: R17.2 v21.59,69.6 R18.2 | C6.1 121.92,24.13 121.39,24.66 U2.16 118.4,26.04 C1.1 v118.36,24.64
  Top 1.778: U3.3 19.38,84.33 C3.+ 22,85.45 v22.1,86.87
  pour Bottom: 0.21,100.15 0.21,1.09 151.34,1.09 151.34,100.15
+12V
  Top 1.778: J1.PWR 25.89,90.42 21.84,90.42 18.81,93.46 L2.2
  Bottom 2.54: J1.PWR 28.18,92.71 33.27,92.71 40.39,99.82 120.4,99.82 126.66,93.56 RC_PWR.MP
ACTION_SW_ON
  Bottom 0.305: CPU1.PA15 28.24,26.92 91.19,26.92 93.55,24.56 K11.3
ANALOG_4_ADC
  Top 0.305: CPU1.PA18 28,19.3 30.48,19.3 32.26,17.53 38.86,17.53 44.2,22.86 44.2,24.55 R21.2 R22.1
ANALOG_4_ADC1
  Top 0.305: 28,21.84 CPU1.PA17 28.26,22.1 30.48,22.1 37.85,29.46 R2.1 R1.2
ANALOG_4_IN  (via drill 0.46)
  Top 0.305: v48.77,28.45 48.77,25.65 47.75,24.64 R21.1
  Bottom 0.305: v48.77,28.45 64.71,44.39 5V_TST.MP
GND
  pour Top: 0.71,100.15 150.57,100.15 150.57,1.09 0.71,1.09
GPIO1_IN_ON  (via drill 0.46)
  Top 0.305: v24.13,76.96 16.76,76.96 14.99,75.18 v14.99,56.9
  Bottom 0.305: K1.3 52.23,72.9 33.78,72.9 29.72,76.96 v24.13,76.96 | v14.99,56.9 10.53,52.44 CPU1.PA31
GPIO1_OUT_ON  (via drill 0.46)
  Top 0.305: v32.26,65.79 30.48,64.01 25.91,64.01 v22.35,60.45
  Bottom 0.305: K2.3 61.98,65.79 v32.26,65.79 | v22.35,60.45 20.83,60.45 10.28,49.9 CPU1.PA30
GPIO2_IN_ON  (via drill 0.46)
  Top 0.305: v31.5,46.99 30.73,46.23 v23.62,46.23 | v14.48,50.55 v14.48,46.23
  Bottom 0.305: K3.3 67.06,64.52 40.13,64.52 33.53,57.91 33.53,48.51 32,46.99 v31.5,46.99 | v23.62,46.23 19.05,41.66 17.27,41.66 14.48,44.45 v14.48,46.23 | v14.48,50.55 11.29,47.36 CPU1.PA29
GPIO2_OUT_ON  (via drill 0.46)
  Top 0.305: v34.8,55.37 33.78,56.39 v26.16,56.39 | v16.76,49.28 15.75,50.29 v15.75,53.34
  Bottom 0.305: K4.3 73.15,64.26 73.15,62.23 71.12,60.2 51.31,60.2 48.51,62.99 40.64,62.99 34.8,57.15 v34.8,55.37 | v26.16,56.39 19.05,49.28 v16.76,49.28 | v15.75,53.34 11.18,48.77 3.81,48.77 2.79,47.75 2.79,46.48 4.45,44.82 CPU1.PA28
GPIO3_IN_ON  (via drill 0.46)
  Top 0.305: v36.07,53.85 24.89,53.85 23.62,52.58 v23.62,50.04 | v13.46,34.8 9.14,39.12 9.14,40.64 7.5,42.28 CPU1.PA27
  Bottom 0.305: v36.07,53.85 38.61,53.85 39.88,55.12 70.61,55.12 74.17,58.67 74.17,63.75 75.44,65.02 80.26,65.02 K5.3 | v13.46,34.8 13.46,46.99 14.48,48.01 21.59,48.01 v23.62,50.04
GPIO3_OUT_ON  (via drill 0.46)
  Top 0.305: v8.89,30.48 v8.89,33.78 | v33.53,44.2 33.02,44.7 v33.02,46.74 | v40.39,53.59 v40.39,56.13 | v69.85,55.88 v73.66,55.88
  Bottom 0.305: K6.3 86.11,64.52 86.11,60.96 84.58,59.44 80.52,59.44 78.99,57.91 78.99,56.64 78.23,55.88 v73.66,55.88 | CPU1.PA26 8.89,36.12 v8.89,33.78 | v8.89,30.48 12.19,30.48 17.78,36.07 30.23,36.07 33.53,39.37 v33.53,44.2 | v33.02,46.74 39.88,53.59 v40.39,53.59 | v40.39,56.13 40.64,55.88 v69.85,55.88
JTAG-TCK
  Bottom 0.305: J2.9 143.26,42.16 138.18,42.16 135.64,39.62 109.73,39.62 107.03,36.93 JTAG5.MP
JTAG-TDI
  Bottom 0.305: J2.5 139.7,46.99 134.62,41.91 108.2,41.91 101.92,35.63 JTAG3.MP
JTAG-TDO
  Bottom 0.305: J2.13 141.73,38.61 111.25,38.61 109.56,36.91 JTAG6.MP
JTAG-TMS
  Bottom 0.305: J2.7 143.26,44.7 138.94,44.7 135.13,40.89 108.97,40.89 104.48,36.41 JTAG4.MP
LED_FAIL
  Bottom 0.305: FAIL.K 30.48,72.39 30.48,63.25 29.84,62.6 CPU1.PA1
LED_SUCCESS
  Bottom 0.305: WIN.K 24.38,70.87 24.38,62.99 27.31,60.06 CPU1.PA2
N$1  (via drill 0.6)
  other vias: 127.33,68.15
N$2
  Top 0.305: K1.4 57.48,76.79 63.5,82.8 68.47,82.8 GPIO1_IN.MP
N$3
  Top 0.305: K2.4 63.83,76.03 65.53,77.72 68.48,77.72 GPIO1_OUT.MP
N$4
  Top 0.305: K3.4 70.18,73.23 71.12,74.17 71.12,82.3 71.63,82.8 73.54,82.8 GPIO2_IN.MP
N$5
  Top 0.305: K4.4 73.6,75.65 GPIO2_OUT.MP
N$6
  Top 0.305: K5.4 82.88,81.71 81.79,82.8 78.77,82.8 GPIO3_IN.MP
N$8
  Top 0.305: K6.4 87.12,70.61 82.04,70.61 78.68,73.97 GPIO3_OUT.MP
N$9
  Top 0.305: R4.1 105.68,90.32 RC_ANALOG7.MP 105.66,87.44 R3.2
N$10  (via drill 0.46)
  Top 0.305: RC_TIMER2.MP 64.08,84.33 62.23,84.33 51.56,73.66 45.72,73.66 37.08,65.02 37.08,61.98 34.8,59.69 v30.48,59.69
  Bottom 0.305: v30.48,59.69 29.46,58.67 24.13,58.67 11.94,46.48 11.94,34.54 9.52,32.12 CPU1.PA23
N$11
  Top 0.305: RC_TIMER3.MP 68.28,89.92 58.42,89.92 56.13,92.2 39.62,92.2 36.58,89.15 34.54,89.15 31.75,86.36 31.75,82.04 30.73,81.03 16,81.03 12.45,77.47 12.45,61.98 6.6,56.13 3.56,56.13 2.54,55.12 2.54,35.81 3.69,34.66 CPU1.PA24 5.14,34.54
N$12
  Top 0.305: K1.1 K2.1 65.1,57.48 67.06,59.44 67.06,72.39 70.36,75.69 70.36,78.37 GPIO1_COM.MP
N$13
  Top 0.305: K3.1 K4.1 76.38,57.48 73.66,60.2 73.66,74.17 73.41,74.17 71.88,75.69 71.88,78.5 GPIO2_COM.MP 73.56,80.26
N$14  (via drill 0.46)
  Top 0.305: v43.18,47.5 v43.18,56.9 | v43.18,61.47 52.32,70.61 52.32,72.9 62.99,83.57 65.79,83.57 67.31,85.09 73.15,85.09 74.27,86.21 RC_GPIO1.MP | v9.4,28.19 9.4,25.65 8.13,24.38 5.38,24.38 CPU1.PA20
  Bottom 0.305: v43.18,56.9 v43.18,61.47 | 43.69,47.5 v43.18,47.5 41.91,47.5 39.12,44.7 39.12,40.13 29.72,30.73 26.42,30.73 23.88,28.19 v9.4,28.19
N$16  (via drill 0.46)
  Top 0.305: R1.1 v54.61,31.75
  Bottom 0.305: v54.61,31.75 68.52,45.66 3.3VTST.MP
N$17
  Bottom 0.305: PWM1_SW1.MP 114.75,59.89 116.59,61.72 122.08,61.72 K7.4
N$18
  Bottom 0.305: CPU1.AD7 6.98,62.6 8.13,63.75 8.13,66.04 7.37,66.8 7.37,77.98 8.38,78.99 39.62,78.99 51.05,90.42 105.41,90.42 107.44,88.39 107.44,85.85 108.46,84.84 121.92,84.84 123.19,86.11 123.19,87.43 RC_PWM4.MP
N$19  (via drill 0.46)
  Top 0.305: v7.37,82.8 7.37,61.47 6.1,60.2 5.4,60.2 CPU1.AD6
  Bottom 0.305: RC_PWM3.MP 119.67,88.36 114.3,93.73 48.01,93.73 37.08,82.8 v7.37,82.8
N$20  (via drill 0.46)
  Top 0.305: v2.29,80.77 2.29,60.5 CPU1.AD5
  Bottom 0.305: RC_PWM2.MP 116.17,88.3 111.76,92.71 49.02,92.71 37.59,81.28 2.79,81.28 v2.29,80.77
N$21
  Bottom 0.305: RC_PWM1.MP 108.73,91.44 50.04,91.44 38.61,80.01 3.81,80.01 2.79,78.99 2.79,62.23 3.81,61.21 7.11,61.21 7.87,60.45 7.87,55.63 7.37,55.12 5.4,55.12 CPU1.AD4
N$22
  Top 0.305: R6.1 102.18,90.26 RC_ANALOG6.MP 102.11,87.38 R5.2
N$23
  Top 0.305: SPI_CLK.MP 50.38,83.73 49.02,85.09 41.15,85.09 35.81,79.76 17.02,79.76 13.21,75.95 13.21,38.61 22.35,29.46 28,29.46 CPU1.PA14
N$24  (via drill 0.46)
  Top 0.305: SPI_MOSI.MP 45.28,79.57 36.32,70.61 30.23,70.61 28.96,69.34 28.96,68.33 23.37,62.74 v22.35,62.74 | v19.3,62.48 19.3,37.85 24.89,32.26 27.99,32.26 CPU1.PA13
  Bottom 0.305: v22.35,62.74 19.56,62.74 v19.3,62.48
N$25  (via drill 0.46)
  Top 0.305: v37.08,74.68 32.26,74.68 27.43,69.85 27.43,68.58 23.88,65.02 22.1,65.02 21.08,64.01 21.08,37.59 24.13,34.54 28,34.54 CPU1.PA12
  Bottom 0.305: SPI_MISO.MP 44.79,82.38 v37.08,74.68
N$26
  Top 0.305: SPI_CS.MP 51.65,77.56 50.29,76.2 43.94,76.2 34.29,66.55 34.29,65.53 29.97,61.21 24.64,61.21 22.35,58.93 22.35,40.64 25.65,37.34 27.99,37.34 CPU1.PA11
N$27  (via drill 0.46)
  Top 0.305: v48.77,60.45 v51.05,62.74 | v34.54,52.58 34.04,53.09 v31.24,53.09
  Bottom 0.305: RC_GPIO2.MP 77.73,87.12 83.82,81.03 83.82,76.96 76.96,70.1 75.69,70.1 70.36,64.77 69.34,64.77 65.79,61.21 52.58,61.21 v51.05,62.74 | v48.77,60.45 46.99,62.23 41.4,62.23 35.81,56.64 35.81,54.86 34.54,53.59 v34.54,52.58 | v31.24,53.09 30.48,53.85 26.16,53.85 24.64,52.32 24.64,45.47 23.88,44.7 23.88,42.16 26.3,39.74 CPU1.PA10
N$28
  Top 0.305: R8.1 98.68,90.21 RC_ANALOG5.MP 98.81,87.33 R7.2
N$29
  Top 0.305: R10.1 95.19,90.27 RC_ANALOG4.MP 95.25,87.39 R9.2
N$30
  Top 0.305: R12.1 RC_ANALOG3.MP R11.2
N$31
  Top 0.305: K6.1 K5.1 82.88,58.85 80.26,61.47 80.26,71.37 76.71,74.93 76.71,79.5 77.47,80.26 78.63,80.26 GPIO3_COM.MP
N$32
  Top 0.305: ACTION_SW1.MP 100.98,21.34 87.12,21.34 84.5,23.95 K11.1
N$33
  Top 0.305: R14.1 88.19,90.28 RC_ANALOG2.MP 88.14,87.4 R13.2
N$34
  Top 0.305: R16.1 84.69,90.19 RC_ANALOG1.MP 84.58,87.31 R15.2
N$35
  Bottom 0.305: RC_ANALOG9.MP 10.46,76.71 21.59,76.71 28.12,70.17 CPU1.PA0
N$36
  Top 1.778: L2.1 D15.A
N$37
  Top 0.254: R19.1 CDS.MP
  Top 0.305: CPU1.PA19 27.94,16.7 27.94,7.37 32.26,3.05 89.41,3.05 90.26,3.9 R19.1
N$38
  Top 0.305: C7.1 130.52,26.04 U2.1
N$39
  Top 0.305: U2.3 127.66,28.45 128.78,28.45 129.45,27.77 C7.2
N$40
  Top 0.305: C8.1 130.34,29.84 U2.4
N$41
  Top 0.305: C8.2 130.34,31.11 U2.5
N$42
  Top 0.305: C6.2 125.31,27.01 125.48,27.18 127.41,27.18 U2.2
N$43
  Top 0.305: C9.1 129.75,32.38 U2.6
N$44  (via drill 0.46)
  Top 0.305: v123.7,29.97 123.57,29.84 U2.13
  Bottom 0.305: SER0_RC_TX.MP 121.67,24.87 121.67,28.96 122.68,29.97 v123.7,29.97
N$45  (via drill 0.46)
  Top 0.305: v123.7,28.45 123.57,28.57 U2.14
  Bottom 0.305: SER0_RC_RX.MP 117.94,19.56 120.9,19.56 123.7,22.35 v123.7,28.45
N$46  (via drill 0.46)
  Top 0.305: v125.48,34.8 127.41,34.8 U2.8
  Bottom 0.305: SER1_RC_TX.MP 129.82,30.45 v125.48,34.8
N$47  (via drill 0.46)
  Top 0.305: v124.46,33.27 124.84,33.66 U2.7
  Bottom 0.305: SER1_RC_RX.MP 128.83,19.76 127.76,20.83 127.76,29.97 v124.46,33.27
N$48
  Top 0.305: K11.4 98.55,24.03 98.55,26.92 99.82,28.19 104.65,28.19 106.12,26.73 ACTION_SW2.MP
N$49
  Top 0.305: TEST.MP K12.4
N$50
  Top 0.305: RESET.MP 74.67,45.29 K13.4
N$51
  Top 0.305: WIN.A 17.69,74.33 R17.1
N$52
  Bottom 0.305: K7.1 122.86,48.59 120.4,51.05 114.84,51.05 PWM1_SW2.MP
N$53
  Bottom 0.305: K8.4 112.6,63.83 111,62.23 111,59.99 PWM2_SW1.MP
N$54
  Bottom 0.305: K8.1 112.95,48.59 111,50.55 111,52.21 PWM2_SW2.MP
N$55
  Bottom 0.305: K9.4 107.11,63.83 108.46,62.48 108.46,59.97 PWM3_SW1.MP
N$56
  Bottom 0.305: K9.1 106.76,48.59 108.71,50.55 108.71,52.07 PWM3_SW2.MP
N$57
  Bottom 0.305: PWM4_SW1.MP 105.72,59.89 103.89,61.72 97.42,61.72 K10.4
N$58
  Bottom 0.305: K10.1 95.58,48.59 98.04,51.05 104.75,51.05 PWM4_SW2.MP
N$59
  Top 0.305: RC_VREF.MP 109.22,87.45 109.22,91.44 108.62,92.04 R4.2 R6.2 R8.2 R10.2 R12.2 R14.2 R16.2
N$60  (via drill 0.46)
  Top 0.305: v42.16,43.94 v37.59,48.51 | v11.68,27.18 11.68,35.05 9.53,37.2 CPU1.PA25
  Bottom 0.305: RC_GPIO3.MP 81.19,87.21 93.47,74.93 93.47,58.17 89.66,54.36 43.18,54.36 37.59,48.77 v37.59,48.51 | v11.68,27.18 11.68,26.16 12.95,24.89 22.86,24.89 26.16,28.19 31.5,28.19 42.16,38.86 v42.16,43.94
N$61
  Top 0.305: FAIL.A 25.49,74.51 R18.1
NRST
  Bottom 0.254: J2.15 144.78,35.56 147.32,35.56 148.34,36.58 148.34,47.5 147.57,48.26 145.03,48.26 143.76,49.53 J2.3
  Bottom 0.305: JTAG2.MP 99.57,32.25 99.57,35.05 107.44,42.93 133.86,42.93 140.46,49.53 J2.3
PWM1_ANALOG_ON
  Top 0.305: K7.3 121.06,55.63 94.74,55.63 92.96,53.85 48.26,53.85 44.2,57.91 41.91,57.91 41.52,57.52 CPU1.PA3
PWM2_ANALOG_ON
  Top 0.305: CPU1.PA4 27.99,55.12 26.16,55.12 25.15,56.13 25.15,57.66 26.16,58.67 46.99,58.67 50.55,55.12 91.44,55.12 93.22,56.9 116.23,56.9 K8.3
PWM3_ANALOG_ON
  Bottom 0.305: K9.3 101.4,57.72 98.55,54.86 98.55,53.34 96.77,51.56 44.2,51.56 37.59,44.96 28.26,44.96 CPU1.PA8
PWM4_ANALOG_ON
  Bottom 0.305: K10.3 95.31,57.72 90.42,52.83 43.43,52.83 36.58,45.97 26.42,45.97 25.15,44.7 25.15,43.69 26.55,42.28 CPU1.PA9
RXD0
  Top 0.305: U2.12 122.56,31.11 123.19,31.75 123.19,37.85 121.41,39.62 89.15,39.62 87.38,37.85 65.02,37.85 62.48,35.31 42.16,35.31 40.64,36.83 40.64,42.42 30.48,52.58 28.26,52.58 CPU1.PA5
RXD1  (via drill 0.46)
  Top 0.305: v121.92,37.08 121.39,36.55 U2.9
  Bottom 0.305: CPU1.PA21 5.38,26.92 7.62,26.92 11.68,22.86 11.68,6.1 15.75,2.03 107.7,2.03 113.03,7.37 113.03,27.69 117.09,31.75 117.09,35.81 118.36,37.08 v121.92,37.08
SAFE12V
  Top 1.778: D15.C 9.05,91.33 C2.+ 13.44,84 U3.1
TIMER0_STIM  (via drill 0.46)
  Top 0.305: RC_TIMER1.MP 51.43,75.18 44.96,75.18 35.56,65.79 v35.56,64.01
  Bottom 0.305: v35.56,64.01 32.26,60.71 32.26,49.28 30.34,47.36 CPU1.PA7
TXD0
  Top 0.305: U2.11 121.26,32.26 118.62,32.26 114.3,36.58 66.8,36.58 64.01,33.78 40.64,33.78 39.12,35.31 39.12,41.91 30.99,50.04 28.26,50.04 CPU1.PA6
TXD1  (via drill 0.46)
  Top 0.305: U2.10 121.26,33.53 v119.13,33.53 | v9.4,23.37 9.4,24.38 v10.67,25.65
  Bottom 0.305: 14.99,1.27 15.24,1.27 | v119.13,33.53 119.13,32.26 115.32,28.45 115.32,6.6 109.98,1.27 15.24,1.27 | 15.24,1.27 10.67,5.84 10.67,22.1 v9.4,23.37 | v10.67,25.65 10.16,25.65 6.23,29.58 CPU1.PA22
V+
  Bottom 1.27: JTAG1.MP 96.77,32.15 96.77,35.05 106.17,44.45 133.35,44.45 140.97,52.07 J2.1 J2.2

### Text on the board
tPlace: START | RaceCapture/Pro Tester | Rev A | Copyright 2012 Autosport Labs